# Altium schematic sheet Voltage Divider Design.SchDoc: Voltage Divider Design
size A4; DocumentNumber: GPH-3110-2; Revision: 1; SheetNumber: 6; SheetTotal: 6; Drawing Number: GPH-3110-2; SPICEModelCacheKATMMPQX: <root> / <DocumentId>KATMMPQX</DocumentId> / <CacheFrame Number="0"> / <Model Name="nmos" Kind="MDL"> / <Text>*Default N-Channel MOSFET / *Pinout: D,G,S / .MODEL NMOS NMOS()</Text> / </Model> / </CacheFrame> / </root>
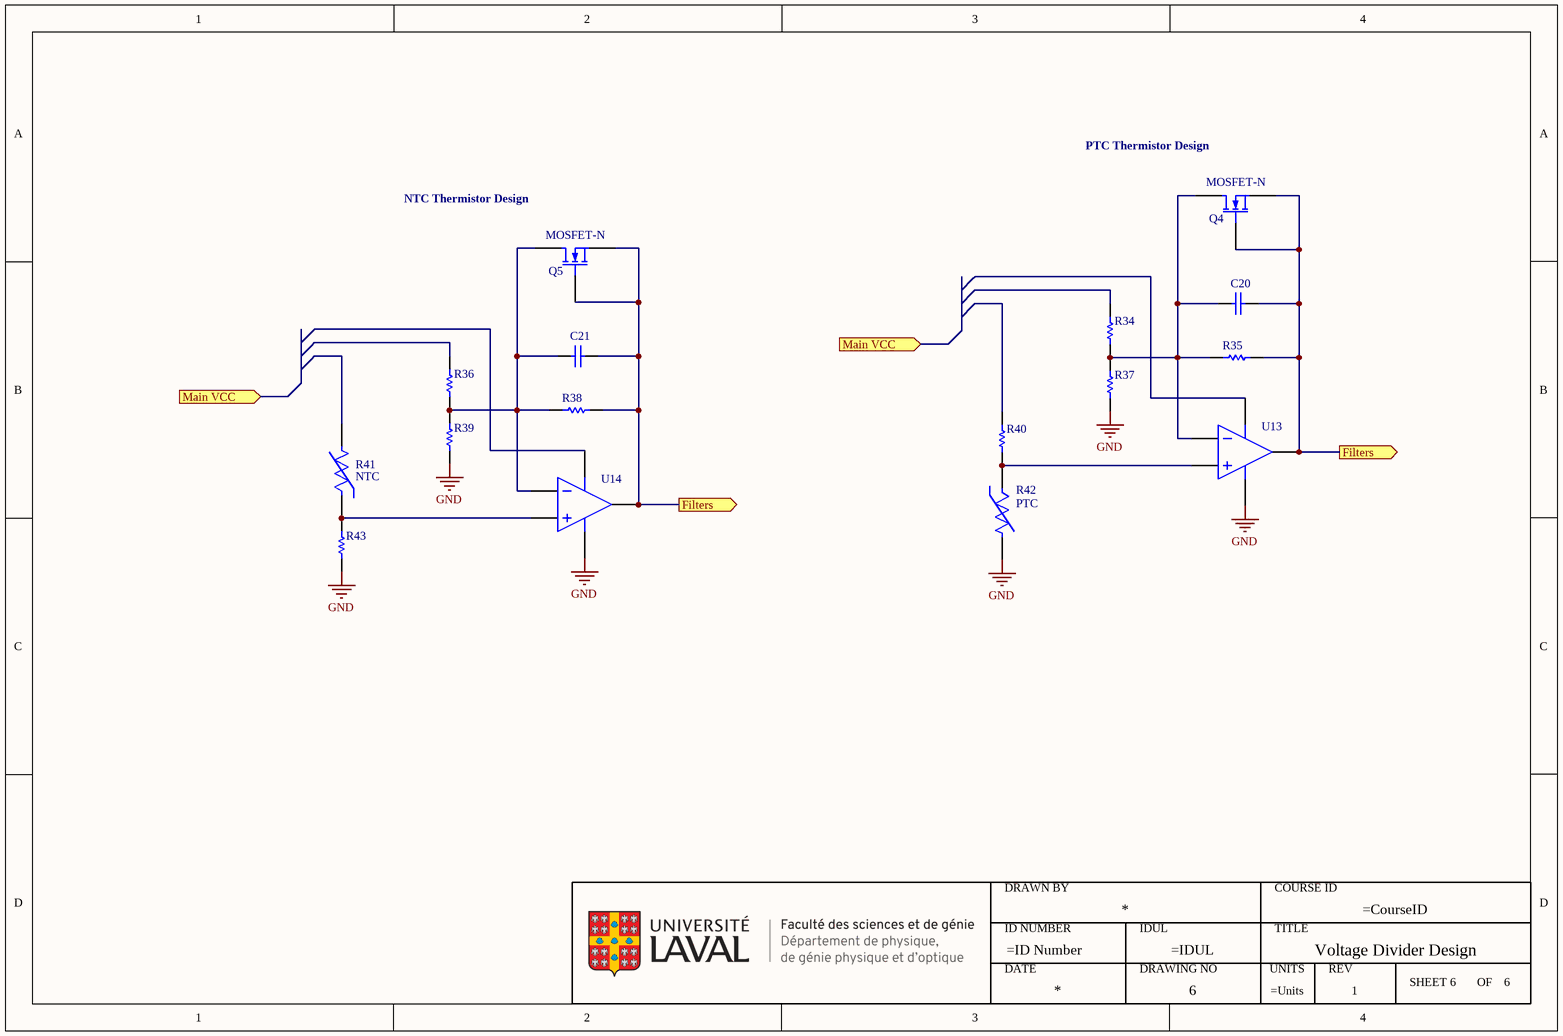
[diagram p0: Voltage Divider Design.SchDoc]

## Parts
*6  ULaval FSG-DPGPO  (value not drawn)
C20  Capacitor  (value not drawn)
C21  Capacitor  (value not drawn)
Q4  MOSFET-N  [E3]
Q5  MOSFET-N  [E3]
R34  Resistor  (value not drawn)
R35  Resistor  (value not drawn)
R36  Resistor  (value not drawn)
R37  Resistor  (value not drawn)
R38  Resistor  (value not drawn)
R39  Resistor  (value not drawn)
R40  Resistor  (value not drawn)
R41  NTC  [FP-DYA0002A-MFG]
R42  PTC  [FP-DYA0002A-MFG]
R43  Resistor  (value not drawn)
U13  Ideal Operational Amplifier  (value not drawn)
U14  Ideal Operational Amplifier  (value not drawn)

## Ports
Filters (out), Main VCC (in)

## Nets
GND: R37.1 R39.1 R42.1(-) R43.1 U13.5(V-) U14.5(V-)
Filters: C20.2 C21.2 Q4.2(G) Q4.3(S) Q5.2(G) Q5.3(S) R35.2 R38.2 U13.3(OUT) U14.3(OUT) ; port Filters
NetC20_1: C20.1 Q4.1(D) R34.2 R35.1 R37.2 U13.1(IN-)
NetC21_1: C21.1 Q5.1(D) R36.2 R38.1 R39.2 U14.1(IN-)
NetR40_1: R40.1 R42.2(+) U13.2(IN+)
NetR41_2: R41.2(+) R43.2 U14.2(IN+)

Not connected (* = marked no-connect by the designer): R34 1; R36 1; R40 2; R41 1(-); U13 4(V+); U14 4(V+)

## Notes on the sheet
- (near Q4) PTC Thermistor Design
- (near Q5) NTC Thermistor Design
- (in symbol ULaval FSG-DPGPO) DRAWN BY; COURSE ID; ID NUMBER; IDUL; TITLE; DATE; DRAWING NO; UNITS; REV; SHEET; OF

## Library data of the parts
C20 C21 = Capacitor: SimulationGenericComponent: True; Value: 1p
Q4 Q5 = MOSFET-N: N-Channel MOSFET; Published: 8-Jun-2000; LatestRevisionDate: 17-Jul-2002; LatestRevisionNote: Re-released for DXP Platform.; PackageVersion: 1995/1996; PackageReference: E3; Publisher: Altium Limited; PackageDescription: TO, Flat Index; 3 In-Line, Axial Leads; Body Dia. 4.6mm; Lead Dia. 0.5 mm (max)
R34-R40 R43 = Resistor: TC1: 0; SimulationGenericComponent: True; Value: 1K; TC2: 0
R41 R42 = CMP-009-00177-1: ±1% tolerance 10kΩ linear thermistor available in 0402 and 0603 package options 2-SOT-5X3 -40 to 125; Max Operating Temperature: 125°C; Mounting Technology: Surface Mount; Min Operating Temperature: -40°C; Series: -; Resistance Tolerance: 1%
U13 U14 = OpAmp with power terminals: SimulationGenericComponent: True; GAIN: 1Meg